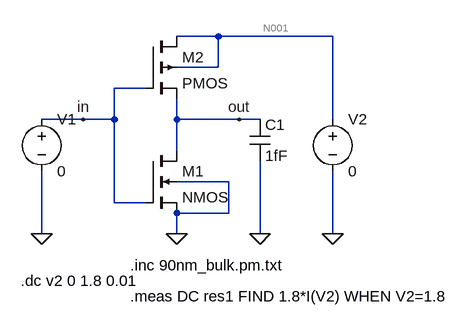
[diagram p0: schematic statpowerconventional@0.asc]
statpowerconventional@0.asc, the LTspice schematic file:
Version 4
SHEET 1 880 680
WIRE 288 64 224 64
WIRE 464 64 288 64
WIRE 288 112 288 64
WIRE 288 112 224 112
WIRE 176 144 128 144
WIRE 80 192 16 192
WIRE 128 192 128 144
WIRE 128 192 80 192
WIRE 224 192 224 160
WIRE 320 192 224 192
WIRE 352 192 320 192
WIRE 464 192 464 64
WIRE 224 240 224 192
WIRE 304 288 224 288
WIRE 128 320 128 192
WIRE 176 320 128 320
WIRE 304 336 304 288
WIRE 304 336 224 336
WIRE 16 368 16 272
WIRE 224 368 224 336
WIRE 352 368 352 256
WIRE 464 368 464 272
FLAG 224 368 0
FLAG 352 368 0
FLAG 464 368 0
FLAG 16 368 0
FLAG 80 192 in
FLAG 320 192 out
SYMBOL nmos4 176 240 R0
SYMATTR InstName M1
SYMATTR Value2 l=100n w=1500n
SYMBOL pmos4 176 64 R0
SYMATTR InstName M2
SYMATTR Value2 l=100n w=4170n
SYMBOL voltage 16 176 R0
WINDOW 123 0 0 Left 0
WINDOW 39 0 0 Left 0
SYMATTR InstName V1
SYMATTR Value 0
SYMBOL voltage 464 176 R0
WINDOW 123 0 0 Left 0
WINDOW 39 0 0 Left 0
SYMATTR InstName V2
SYMATTR Value 0
SYMBOL cap 336 192 R0
SYMATTR InstName C1
SYMATTR Value 1fF
TEXT 152 416 Left 2 !.inc 90nm_bulk.pm.txt
TEXT -16 440 Left 2 !.dc v2 0 1.8 0.01
TEXT 152 464 Left 2 !.meas DC res1 FIND 1.8*I(V2) WHEN V2=1.8

The netlist it stands for:
* statpowerconventional@0.asc
M1 out in 0 0 NMOS l=100n w=1500n
M2 N001 in out N001 PMOS l=100n w=4170n
V1 in 0 0
V2 N001 0 0
C1 out 0 1fF
.model NMOS NMOS
.model PMOS PMOS
.lib standard.mos
.inc 90nm_bulk.pm.txt
.dc v2 0 1.8 0.01
.meas DC res1 FIND 1.8*I(V2) WHEN V2=1.8
.backanno
.end

* Results of the author's LTspice run, read from the files saved beside the schematic
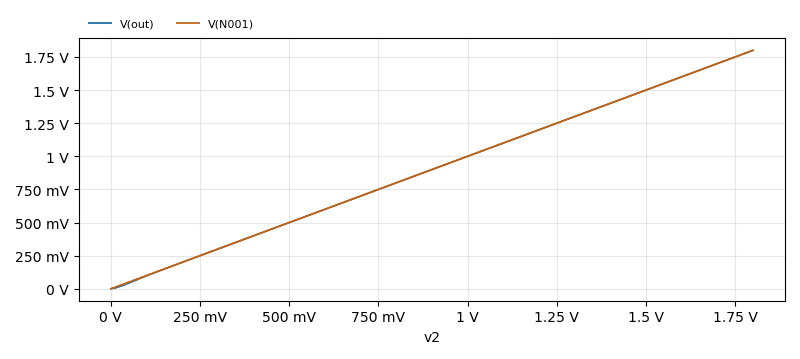
[diagram p1: DC transfer characteristic of statpowerconventional@0.asc, plotted from the saved traces]
* DC transfer characteristic, 1 run:
*   V(out): 0 V at v2=0 V, 1.8 V at v2=1.8 V, min 0 V, max 1.8 V
*   V(N001): 0 V at v2=0 V, 1.8 V at v2=1.8 V, min 0 V, max 1.8 V
* From the log:
*   res1: 1.8*i(v2)=0 at 0